# EAGLE design programadorFLASH-prototipo-plano-masa (EAGLE 4.01)
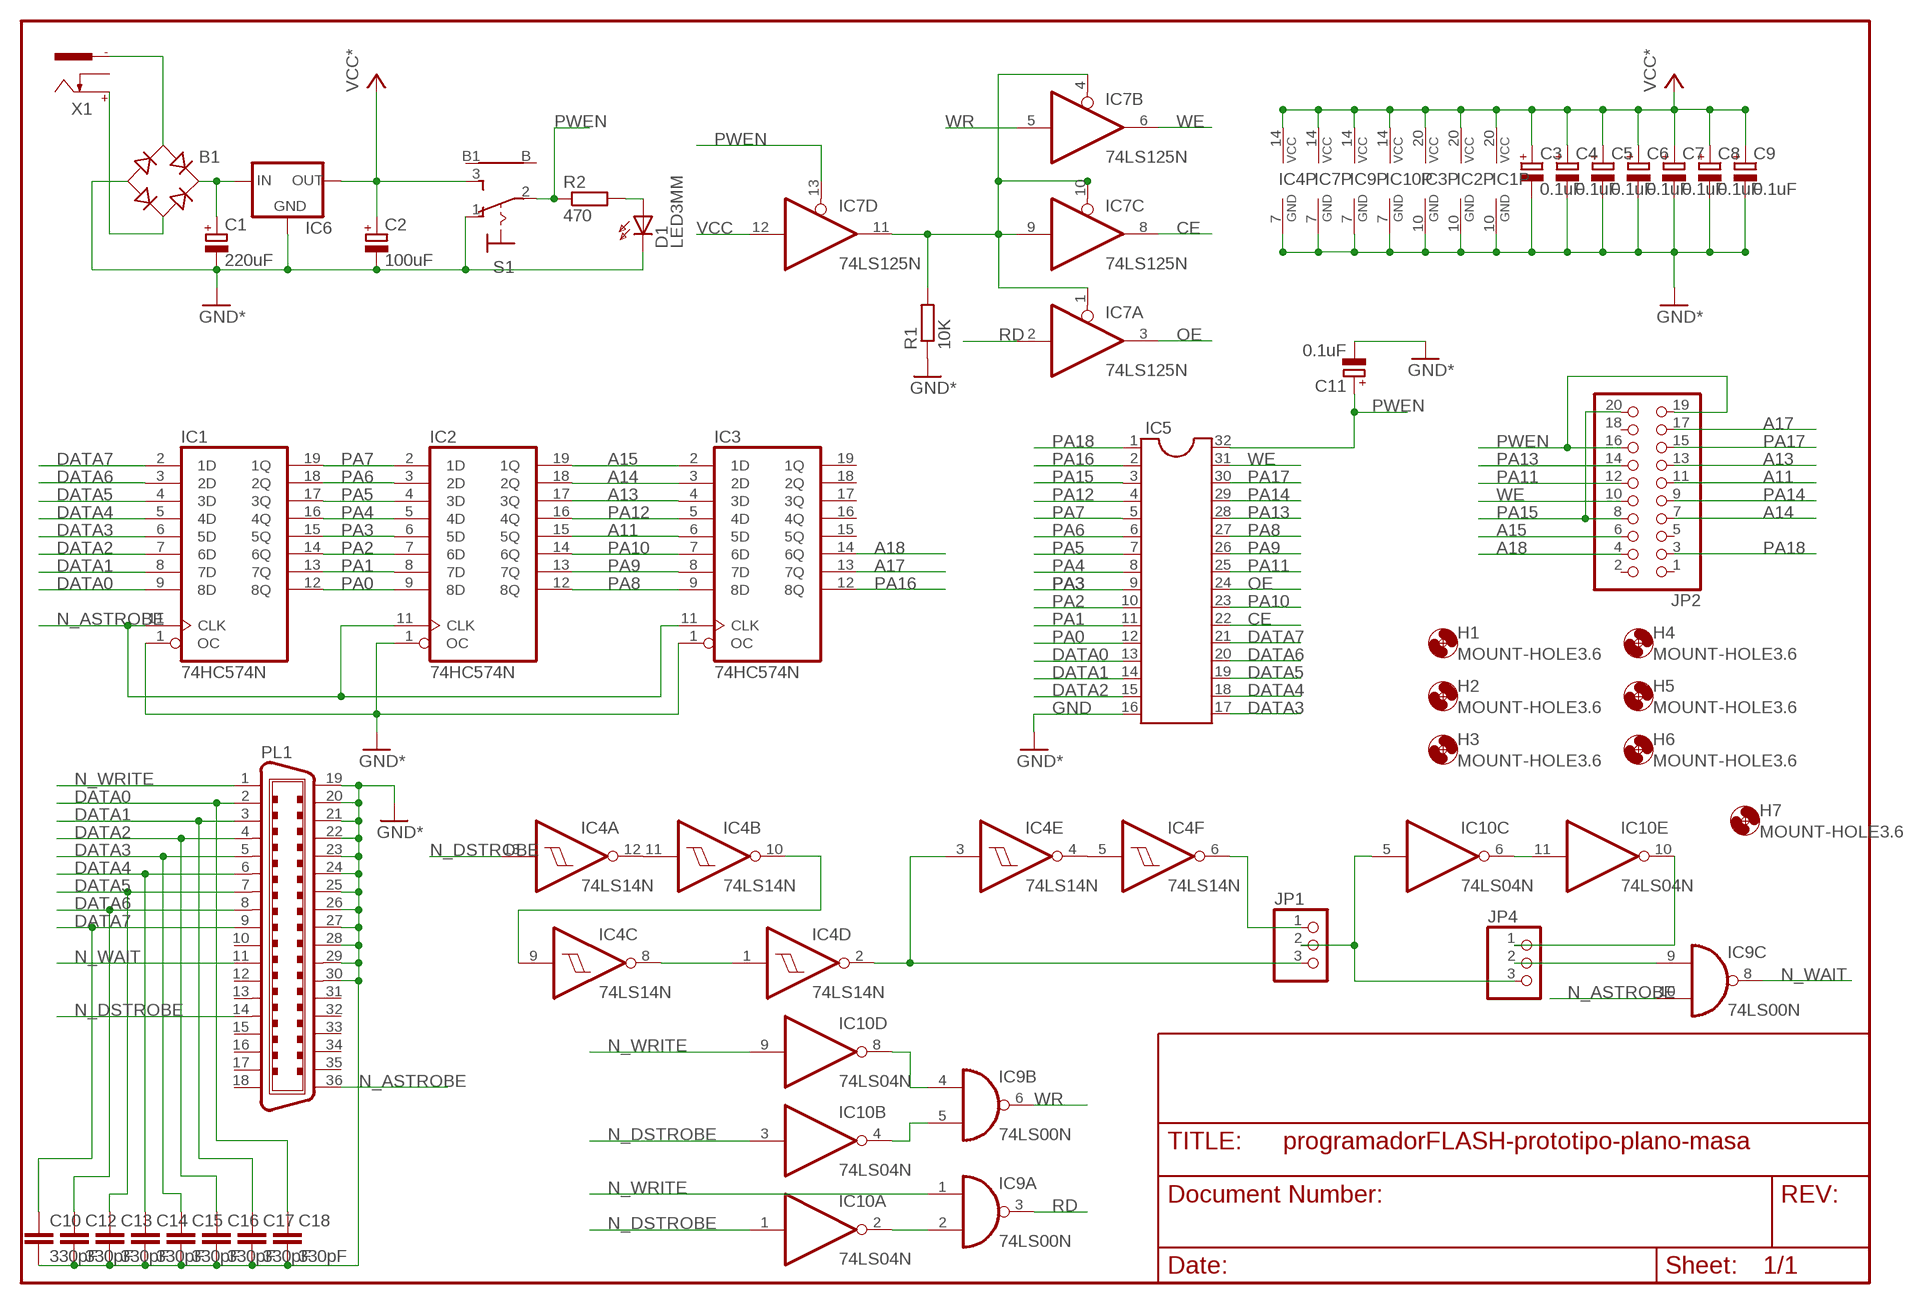
[diagram p0: schematic, sheet 1]

## Parts
B1  RB1A  [RB1A]
C1  220uF  CPOL-EUE3.5-10  [E3,5-10]
C2  100uF  CPOL-EUE2.5-7  [E2,5-7]
C3  0.1uF  CPOL-EUTT5D7  [TT5D7]
C4  0.1uF  CPOL-EUTT5D7  [TT5D7]
C5  0.1uF  CPOL-EUTT5D7  [TT5D7]
C6  0.1uF  CPOL-EUTT5D7  [TT5D7]
C7  0.1uF  CPOL-EUTT5D7  [TT5D7]
C8  0.1uF  CPOL-EUTT5D7  [TT5D7]
C9  0.1uF  CPOL-EUTT5D7  [TT5D7]
C10  330pF  C-EU050-024X044  [C050-024X044]
C11  0.1uF  CPOL-EUTT5D7  [TT5D7]
C12  330pF  C-EU050-024X044  [C050-024X044]
C13  330pF  C-EU050-024X044  [C050-024X044]
C14  330pF  C-EU050-024X044  [C050-024X044]
C15  330pF  C-EU050-024X044  [C050-024X044]
C16  330pF  C-EU050-024X044  [C050-024X044]
C17  330pF  C-EU050-024X044  [C050-024X044]
C18  330pF  C-EU050-024X044  [C050-024X044]
D1  LED3MM  [LED3MM]
H1  MOUNT-HOLE3.6  [3,6]
H2  MOUNT-HOLE3.6  [3,6]
H3  MOUNT-HOLE3.6  [3,6]
H4  MOUNT-HOLE3.6  [3,6]
H5  MOUNT-HOLE3.6  [3,6]
H6  MOUNT-HOLE3.6  [3,6]
H7  MOUNT-HOLE3.6  [3,6]
IC1  74HC574N  [DIL20]
IC2  74HC574N  [DIL20]
IC3  74HC574N  [DIL20]
IC4  74LS14N  [DIL14]
IC5  DIL32  [DIL32]
IC6  78MXXS  [78MXXS]
IC7  74LS125N  [DIL14]
IC9  74LS00N  [DIL14]
IC10  74LS04N  [DIL14]
JP1  PINHD-1X3  [1X03]
JP2  PINHD-2X10  [2X10]
JP4  PINHD-1X3  [1X03]
PL1  C36H  [36H]
R1  10K  R-EU_0207/10  [0207/10]
R2  470  R-EU_0207/10  [0207/10]
S1  INTERRUPTOR  [9070-1W]
X1  NEB21R  [NEB21R]

## Nets
A11: IC2.15(5Q) IC3.6(5D) JP2.11
A13: IC2.17(3Q) IC3.4(3D) JP2.13
A14: IC2.18(2Q) IC3.3(2D) JP2.7
A15: IC2.19(1Q) IC3.2(1D) JP2.6
A17: IC3.13(7Q) JP2.17
A18: IC3.14(6Q) JP2.4
AE: IC7.1(A:OE) IC7.4(B:OE) IC7.9(C:I) IC7.10(C:OE) IC7.11(D:O) R1.2
CE: IC5.22 IC7.8(C:O)
DATA0: C18.2 IC1.9(8D) IC5.13 PL1.2
DATA1: C17.2 IC1.8(7D) IC5.14 PL1.3
DATA2: C16.2 IC1.7(6D) IC5.15 PL1.4
DATA3: C15.2 IC1.6(5D) IC5.17 PL1.5
DATA4: C14.2 IC1.5(4D) IC5.18 PL1.6
DATA5: C13.2 IC1.4(3D) IC5.19 PL1.7
DATA6: C12.2 IC1.3(2D) IC5.20 PL1.8
DATA7: C10.2 IC1.2(1D) IC5.21 PL1.9
GND: B1.- C1.- C2.- C3.- C4.- C5.- C6.- C7.- C8.- C9.- C10.1 C11.- C12.1 C13.1 C14.1 C15.1 C16.1 C17.1 C18.1 D1.K(C) IC1.1(OC) IC1.10(GND) IC2.1(OC) IC2.10(GND) IC3.1(OC) IC3.10(GND) IC4.7(P:GND) IC5.16 IC6.GND IC7.7(P:GND) IC9.7(P:GND) IC10.7(P:GND) PL1.19 PL1.20 PL1.21 PL1.22 PL1.23 PL1.24 PL1.25 PL1.26 PL1.27 PL1.28 PL1.29 PL1.30 R1.1 S1.1(O) ; supply symbol labelled GND*
N$1: IC9.2(A:I1) IC10.2(A:O)
N$2: B1.AC1 X1.-
N$3: B1.+ C1.+ IC6.IN
N$4: D1.A R2.2
N$5: B1.AC2 X1.+
N$6: IC9.5(B:I1) IC10.4(B:O)
N$7: IC9.4(B:I0) IC10.8(D:O)
N$8: IC4.11(B:I) IC4.12(A:O)
N$9: IC4.9(C:I) IC4.10(B:O)
N$10: IC4.1(D:I) IC4.8(C:O)
N$11: IC4.2(D:O) IC4.3(E:I) JP1.3
N$12: IC4.4(E:O) IC4.5(F:I)
N$13: IC4.6(F:O) JP1.1
N$14: IC10.5(C:I) JP1.2 JP4.3
N$15: IC10.6(C:O) IC10.11(E:I)
N$18: IC10.10(E:O) JP4.1
N$19: IC9.9(C:I0) JP4.2
N_ASTROBE: IC1.11(CLK) IC2.11(CLK) IC3.11(CLK) IC9.10(C:I1) PL1.36
N_DSTROBE: IC4.13(A:I) IC10.1(A:I) IC10.3(B:I) PL1.14
N_WAIT: IC9.8(C:O) PL1.11
N_WRITE: IC9.1(A:I0) IC10.9(D:I) PL1.1
OE: IC5.24 IC7.3(A:O)
PA0: IC1.12(8Q) IC2.9(8D) IC5.12
PA1: IC1.13(7Q) IC2.8(7D) IC5.11
PA2: IC1.14(6Q) IC2.7(6D) IC5.10
PA3: IC1.15(5Q) IC2.6(5D) IC5.9
PA4: IC1.16(4Q) IC2.5(4D) IC5.8
PA5: IC1.17(3Q) IC2.4(3D) IC5.7
PA6: IC1.18(2Q) IC2.3(2D) IC5.6
PA7: IC1.19(1Q) IC2.2(1D) IC5.5
PA8: IC2.12(8Q) IC3.9(8D) IC5.27
PA9: IC2.13(7Q) IC3.8(7D) IC5.26
PA10: IC2.14(6Q) IC3.7(6D) IC5.23
PA11: IC5.25 JP2.12
PA12: IC2.16(4Q) IC3.5(4D) IC5.4
PA13: IC5.28 JP2.14
PA14: IC5.29 JP2.9
PA15: IC5.3 JP2.8 JP2.20
PA16: IC3.12(8Q) IC5.2
PA17: IC5.30 JP2.15
PA18: IC5.1 JP2.3
PWEN: C11.+ IC5.32 IC7.13(D:OE) JP2.16 JP2.19 R2.1 S1.2(P)
RD: IC7.2(A:I) IC9.3(A:O)
VCC: C2.+ C3.+ C4.+ C5.+ C6.+ C7.+ C8.+ C9.+ IC1.20(VCC) IC2.20(VCC) IC3.20(VCC) IC4.14(P:VCC) IC6.OUT IC7.12(D:I) IC7.14(P:VCC) IC9.14(P:VCC) IC10.14(P:VCC) S1.3(S) ; supply symbol labelled VCC*
WE: IC5.31 IC7.6(B:O) JP2.10
WR: IC7.5(B:I) IC9.6(B:O)
Unconnected: IC3.15(5Q) IC3.16(4Q) IC3.17(3Q) IC3.18(2Q) IC3.19(1Q) IC9.11(D:O) IC9.12(D:I0) IC9.13(D:I1) IC10.12(F:O) IC10.13(F:I) JP2.1 JP2.2 JP2.5 JP2.18 PL1.10 PL1.12 PL1.13 PL1.15 PL1.16 PL1.17 PL1.18 PL1.31 PL1.32 PL1.33 PL1.34 PL1.35 S1.B S1.B1 X1.C

## Library data of the parts
B1 = rectifier:RB1A: RECTIFIER 1 A
C1-C9 C11 = rcl:CPOL-EU: POLARIZED CAPACITOR, European symbol
C10 C12-C18 = rcl:C-EU: CAPACITOR, European symbol
D1 = led:LED3MM: LED 3 mm, round
H1-H7 = holes:MOUNT-HOLE: MOUNTING HOLE with drill center marker
IC1-IC3 = 74xx-eu:74*574: 8-bit D type FLIP FLOP bus driver
IC4 = 74xx-eu:74*14: Hex schmitt trigger INVERTER
IC5 = dil:DIL32: SOCKET DIL32
IC6 = v-reg:78MXXS: VOLTAGE REGULATOR
IC7 = 74xx-eu:74*125: Quad bus BUFFER, 3-state
IC9 = 74xx-eu:74*00: Quad 2-input NAND gate
IC10 = 74xx-eu:74*04: Hex INVERTER
JP1 JP4 = pinhead:PINHD-1X3: PIN HEADER
JP2 = pinhead:PINHD-2X10: PIN HEADER
PL1 = con-amp-champ:C36H: CONNECTOR
R1 R2 = rcl:R-EU_: RESISTOR, European symbol
S1 = switch:INTERRUPTOR: TOGGLE SWITCH Marquardt
X1 = con-lumberg:NEB21R: CONNECTOR

## Board
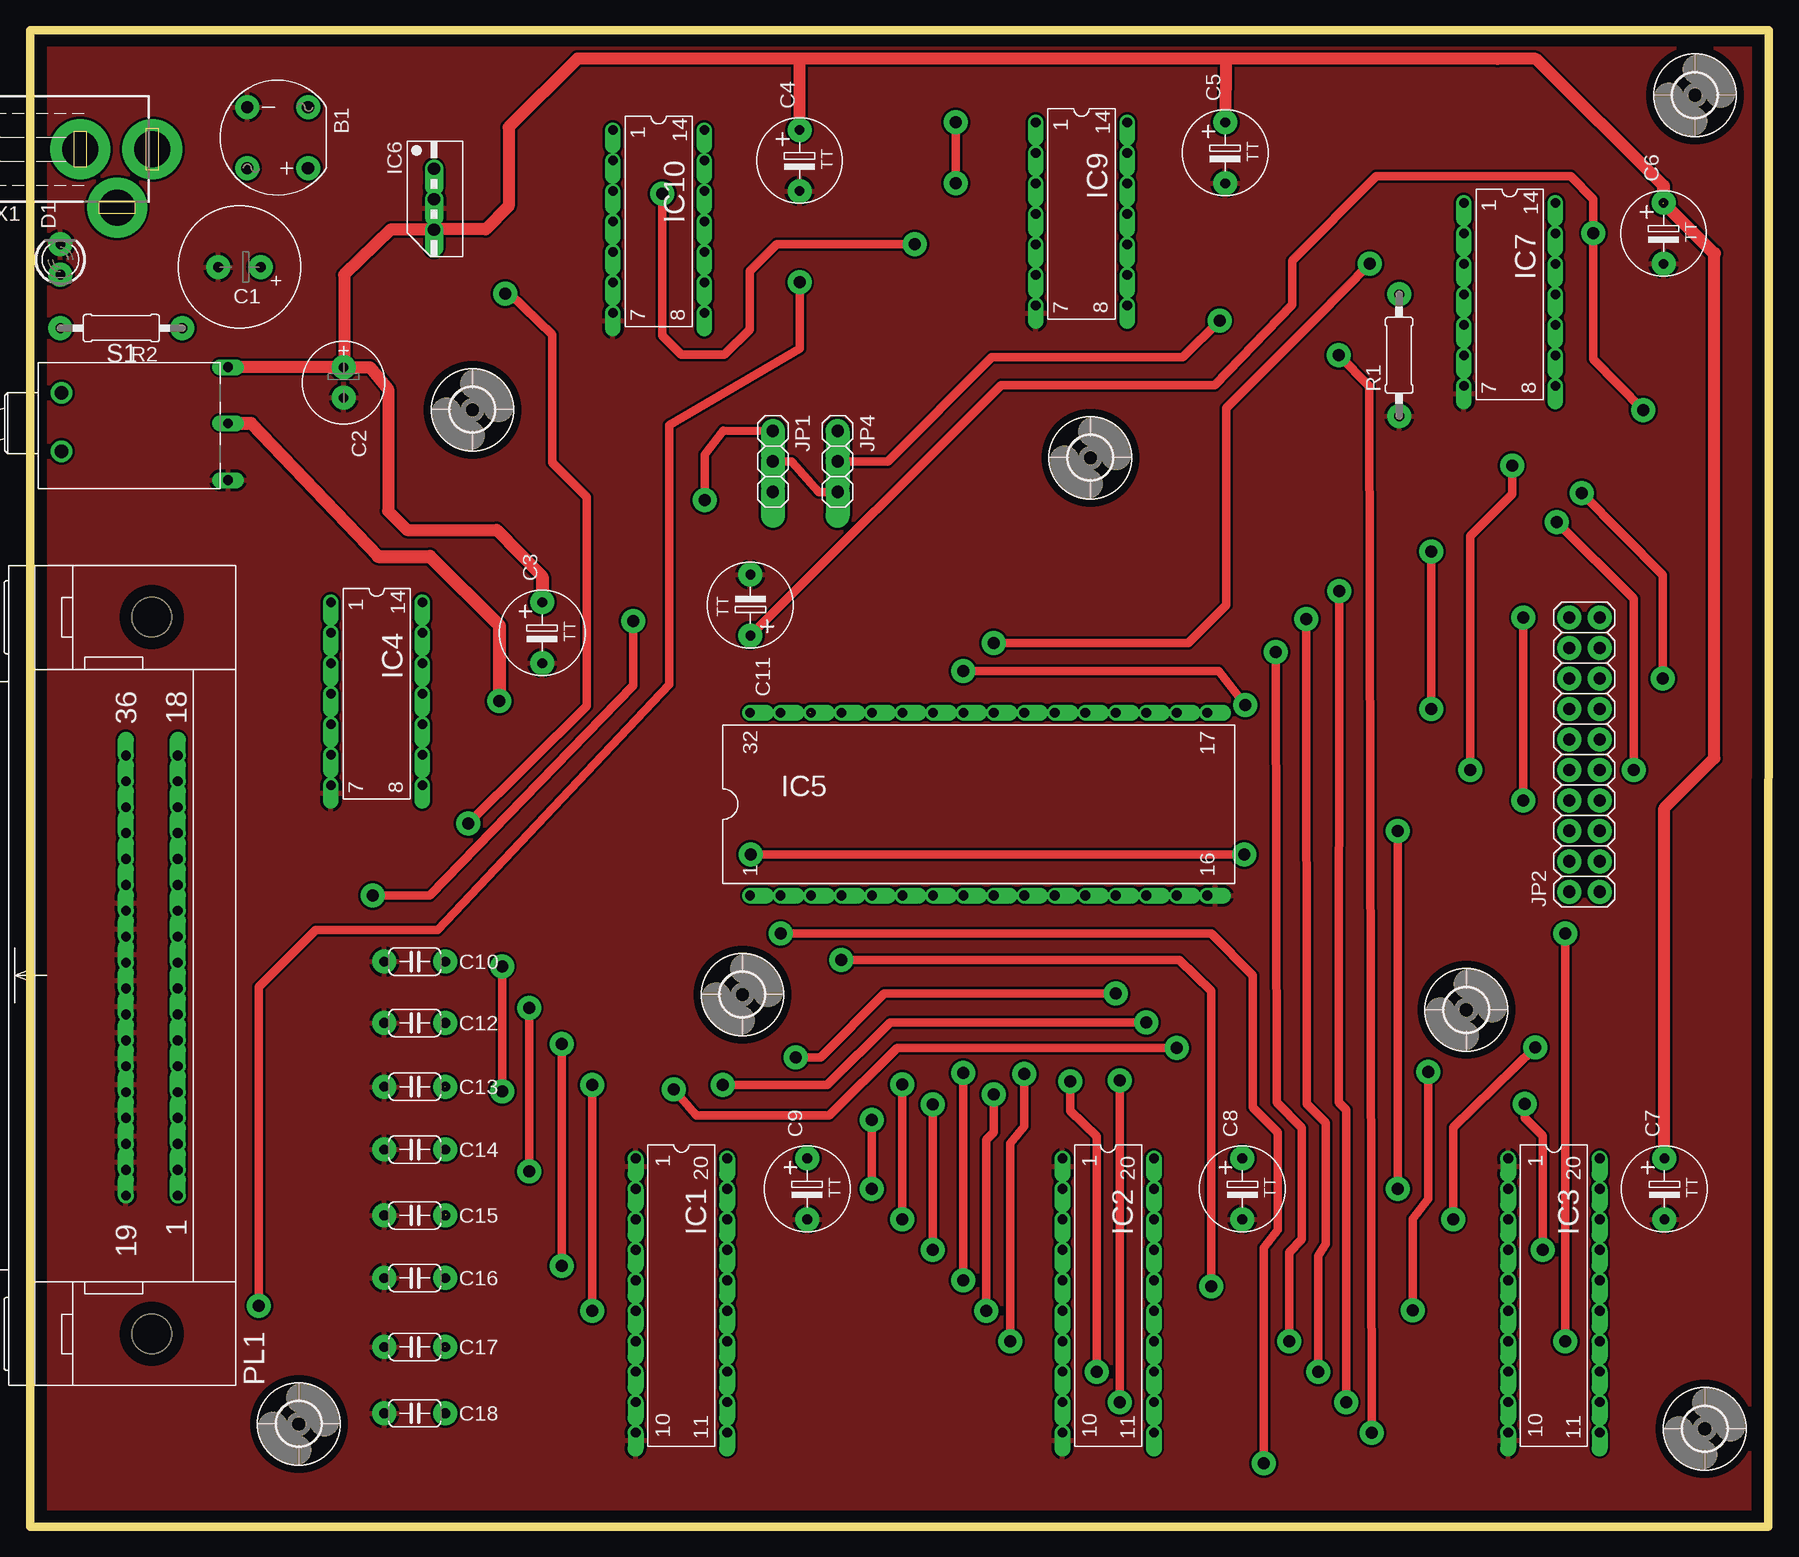
[diagram p1: board, top side]
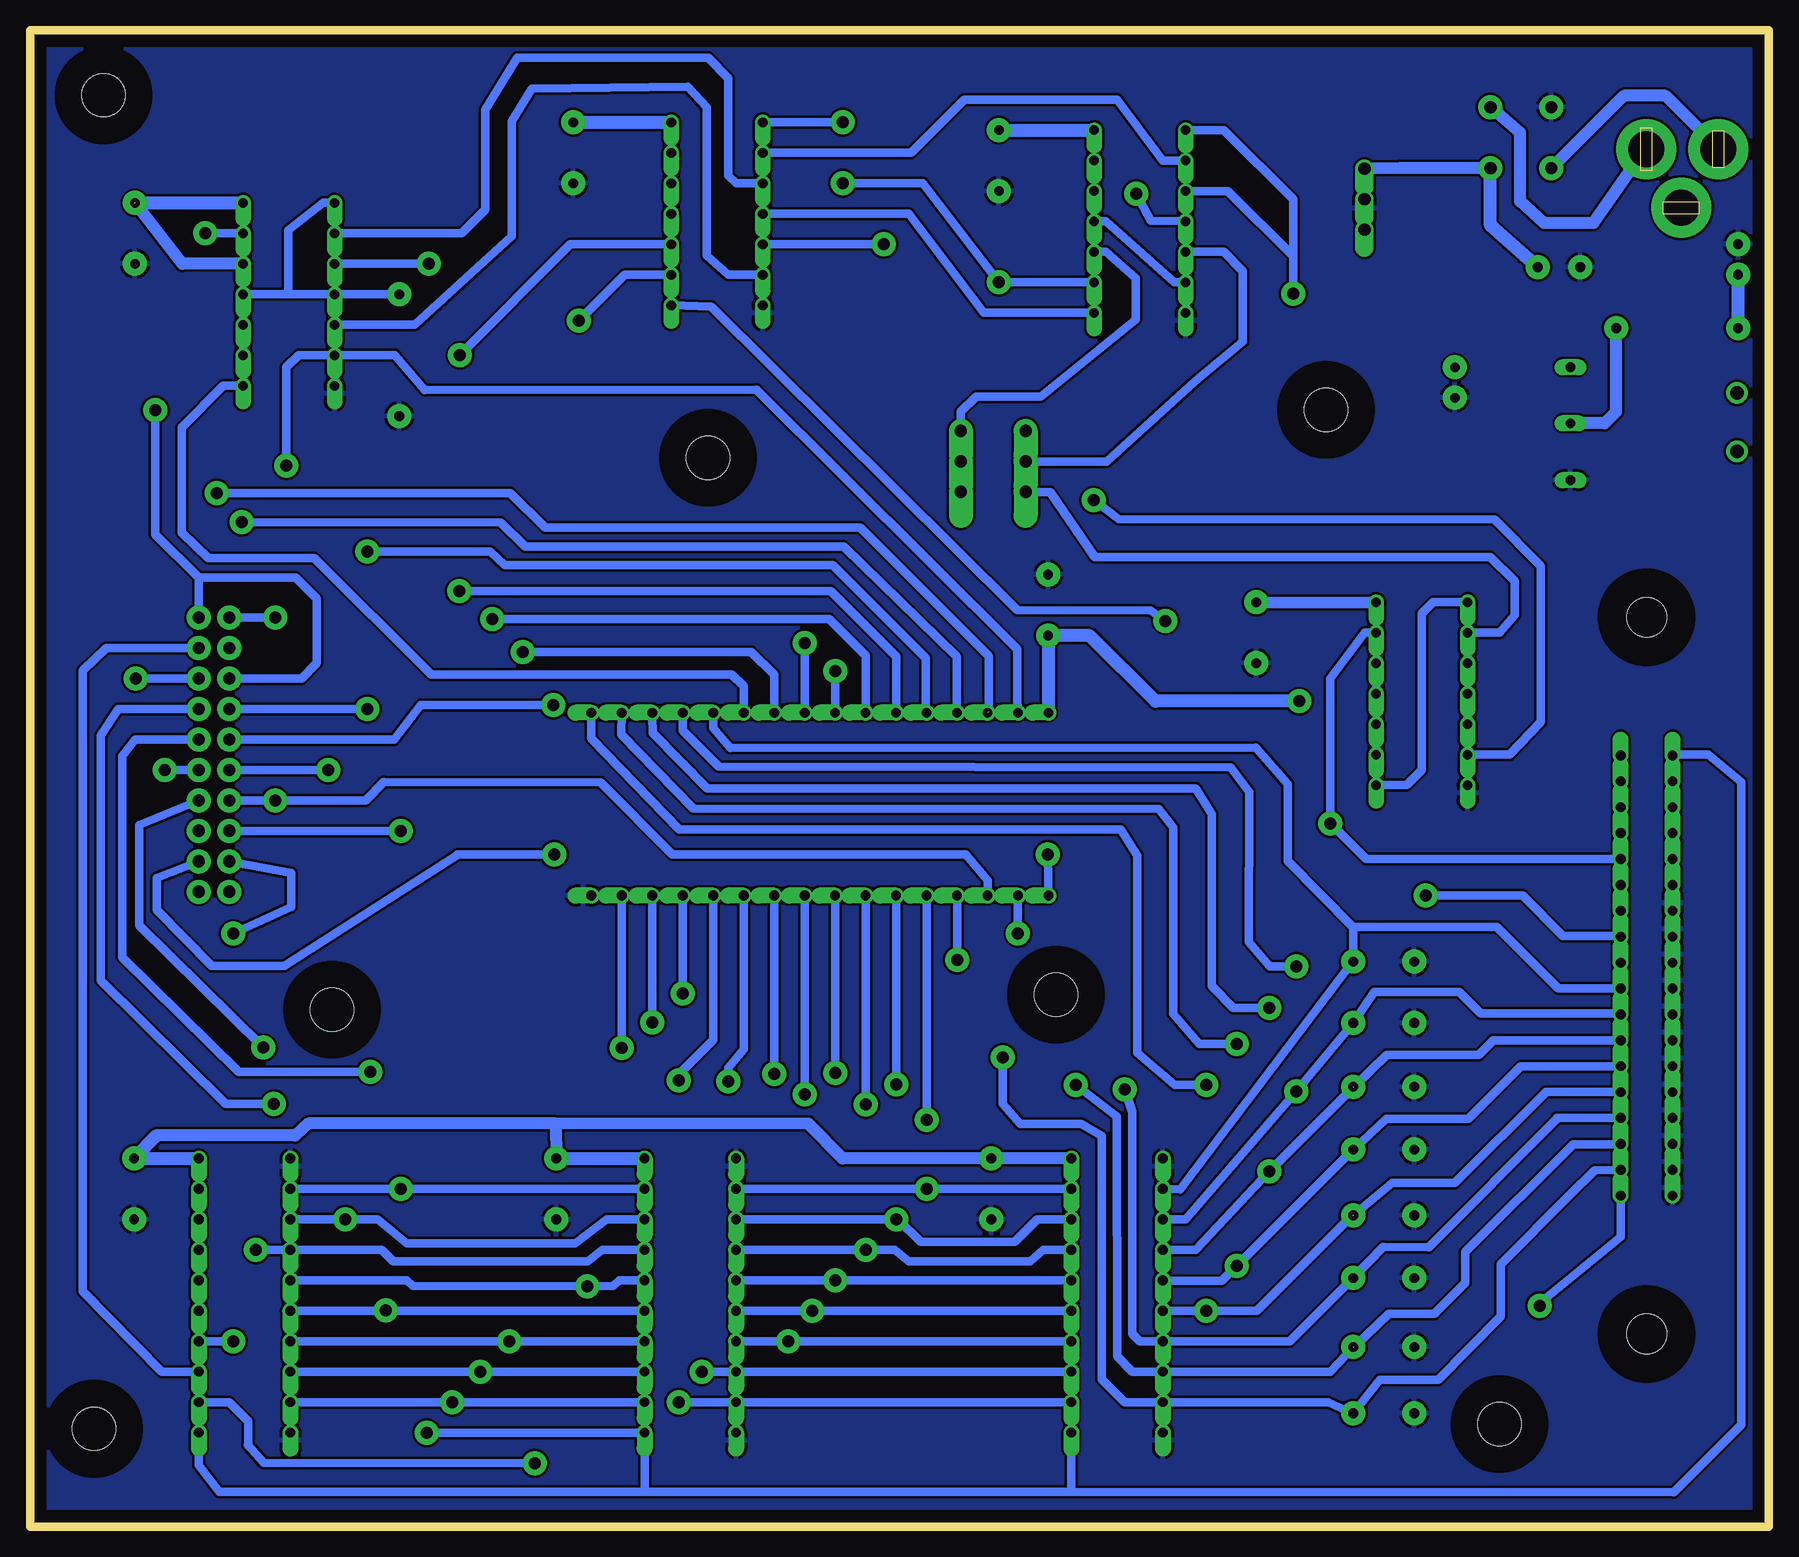
[diagram p2: board, bottom side, seen from below]

Size 144.88 x 124.78 mm. Coordinates in mm from the lower left corner, seen from the top.
Outline: 0,0 144.86,0 144.87,124.78 0,124.78 0,0
Copper layers used: Top, Bottom

### Footprints (pad centres in the part's own frame; a part is rotated, then mirrored left to right if it is on the bottom)
RB1A = drill 1.016 pad 2 round: + -2.54,2.54; - 2.54,-2.54; AC1 2.54,2.54; AC2 -2.54,-2.54
E3,5-10 = drill 0.813 pad 2 round: + -1.778,0; - 1.778,0
E2,5-7 = drill 0.813 pad 2 round: + -1.27,0; - 1.27,0
TT5D7 = drill 0.813 pad 2 round: + 2.54,0; - -2.54,0
C050-024X044 = drill 0.813 pad 2 round: 1 -2.54,0; 2 2.54,0
LED3MM = drill 0.813 pad 2 round: A -1.27,0; K 1.27,0
3,6 = hole 3.6: 0,0
DIL20 = drill 0.813 offset: 1 -11.43,-3.81; 2 -8.89,-3.81; 3 -6.35,-3.81; 4 -3.81,-3.81; 5 -1.27,-3.81; 6 1.27,-3.81; 7 3.81,-3.81; 8 6.35,-3.81; 9 8.89,-3.81; 10 11.43,-3.81; 11 11.43,3.81; 12 8.89,3.81; 13 6.35,3.81; 14 3.81,3.81; 15 1.27,3.81; 16 -1.27,3.81; 17 -3.81,3.81; 18 -6.35,3.81; 19 -8.89,3.81; 20 -11.43,3.81
DIL14 = drill 0.8 offset: 1 -7.62,-3.81; 2 -5.08,-3.81; 3 -2.54,-3.81; 4 0,-3.81; 5 2.54,-3.81; 6 5.08,-3.81; 7 7.62,-3.81; 8 7.62,3.81; 9 5.08,3.81; 10 2.54,3.81; 11 0,3.81; 12 -2.54,3.81; 13 -5.08,3.81; 14 -7.62,3.81
DIL32 = drill 0.813 offset: 1 -19.05,-7.62; 2 -16.51,-7.62; 3 -13.97,-7.62; 4 -11.43,-7.62; 5 -8.89,-7.62; 6 -6.35,-7.62; 7 -3.81,-7.62; 8 -1.27,-7.62; 9 1.27,-7.62; 10 3.81,-7.62; 11 6.35,-7.62; 12 8.89,-7.62; 13 11.43,-7.62; 14 13.97,-7.62; 15 16.51,-7.62; 16 19.05,-7.62; 17 19.05,7.62; 18 16.51,7.62; 19 13.97,7.62; 20 11.43,7.62; 21 8.89,7.62; 22 6.35,7.62; 23 3.81,7.62; 24 1.27,7.62; 25 -1.27,7.62; 26 -3.81,7.62; 27 -6.35,7.62; 28 -8.89,7.62; 29 -11.43,7.62; 30 -13.97,7.62; 31 -16.51,7.62; 32 -19.05,7.62
78MXXS = drill 1.016 offset: GND 0,-2.54; IN -2.54,-2.54; OUT 2.54,-2.54
1X03 = drill 1.016 pad 2 offset: 1 -2.54,0; 2 0,0; 3 2.54,0
2X10 = drill 1.016 pad 2 round: 1 -11.43,-1.27; 2 -11.43,1.27; 3 -8.89,-1.27; 4 -8.89,1.27; 5 -6.35,-1.27; 6 -6.35,1.27; 7 -3.81,-1.27; 8 -3.81,1.27; 9 -1.27,-1.27; 10 -1.27,1.27; 11 1.27,-1.27; 12 1.27,1.27; 13 3.81,-1.27; 14 3.81,1.27; 15 6.35,-1.27; 16 6.35,1.27; 17 8.89,-1.27; 18 8.89,1.27; 19 11.43,-1.27; 20 11.43,1.27
36H = drill 0.813 offset: 1 -18.352,-2.159; 2 -16.192,-2.159; 3 -14.034,-2.159; 4 -11.874,-2.159; 5 -9.716,-2.159; 6 -7.556,-2.159; 7 -5.397,-2.159; 8 -3.239,-2.159; 9 -1.079,-2.159; 10 1.079,-2.159; 11 3.239,-2.159; 12 5.397,-2.159; 13 7.556,-2.159; 14 9.716,-2.159; 15 11.874,-2.159; 16 14.034,-2.159; 17 16.192,-2.159; 18 18.352,-2.159; 19 -18.352,2.159; 20 -16.192,2.159; 21 -14.034,2.159; 22 -11.874,2.159; 23 -9.716,2.159; 24 -7.556,2.159; 25 -5.397,2.159; 26 -3.239,2.159; 27 -1.079,2.159; 28 1.079,2.159; 29 3.239,2.159; 30 5.397,2.159; 31 7.556,2.159; 32 9.716,2.159; 33 11.874,2.159; 34 14.034,2.159; 35 16.192,2.159; 36 18.352,2.159 | hole 3.302: -29.87,0; 29.87,0
0207/10 = drill 0.813 pad 2 round: 1 -5.08,0; 2 5.08,0
9070-1W = drill 0.813 long: 1 5.08,-4.74; 2 5.08,0; 3 5.08,4.68 | drill 1.118 pad 1.778 round: B -8.8,-2.34; B1 -8.8,2.54
NEB21R = drill 3 pad 5 round: + 0,7.35; - 0,1.35; C 4.9,4.4

### Placement (x,y rotation side)
B1  20.63,115.81 180 top
C1  17.46,105.02 180 top
C2  26.13,95.39 270 top
C3  42.68,74.54 90 top
C4  64.12,113.91 90 top
C5  99.6,114.54 90 top
C6  136.13,107.83 90 top
C7  136.2,28.18 90 top
C8  101.02,28.18 90 top
C9  64.77,28.18 90 top
C10  32.06,47.12 0 top
C11  60.04,76.84 270 top
C12  32.06,42.01 0 top
C13  32.06,36.69 0 top
C14  32.06,31.46 0 top
C15  32.06,25.97 0 top
C16  32.06,20.75 0 top
C17  32.06,15 0 top
C18  32.06,9.47 0 top
D1  2.54,105.65 90 top
H1  36.87,93.12 0 top
H2  138.74,119.35 0 top
H3  59.37,44.38 0 top
H4  119.69,43.1 0 top
H5  22.4,8.58 0 top
H6  139.56,8.18 0 top
H7  88.37,89.12 0 top
IC1  54.29,19.29 270 top
IC2  89.85,19.29 270 top
IC3  126.99,19.29 270 top
IC4  28.89,69.46 270 top
IC5  79.05,60.25 0 top
IC6  36.21,110.69 270 top
IC7  123.3,102.75 270 top
IC9  87.62,109.46 270 top
IC10  52.38,108.83 270 top
JP1  61.91,88.83 270 top
JP2  129.53,64.38 90 top
JP4  67.3,88.83 270 top
PL1  10.15,45.96 90 top
R1  114.09,97.67 90 top
R2  7.62,99.94 180 top
S1  11.43,92 0 top
X1  2.85,114.86 270 top

### Tracks (layer width: path | path; a pad name or v marks a point on that pad's centre or on a via)
A11  (via drill 1 pad 2)
  Top 0.7: v116.52,37.95 116.52,27.37 115.25,25.69 v115.25,18.04
  Bottom 0.7: 123.5,18.02 IC3.6 115.25,18.02 | IC2.15 115.25,18.02 | v116.52,37.95 127.49,37.95 137.18,47.46 137.18,64.28 136.1,65.65 JP2.11 | 115.25,18.02 v115.25,18.04
A13  (via drill 1 pad 2)
  Top 0.7: v126.04,23.1 126.08,32.58 124.54,34.08 v124.54,35.25
  Bottom 0.7: IC2.17 97.2,23.1 98.41,22.15 114.61,22.15 115.57,23.1 IC3.4 v126.04,23.1 | v124.54,35.25 128.58,35.25 138.97,45.57 138.97,65.97 137.52,68.19 JP2.13
A14  (via drill 1 pad 2)
  Top 0.7: v125.43,39.96 118.59,33.31 v118.59,25.64
  Bottom 0.7: IC2.18 96.83,25.64 99.46,23.65 113.48,23.65 115.88,25.64 v118.59,25.64 IC3.3 | v125.43,39.96 135.76,50.15 135.76,58.51 JP2.7
A15  (via drill 1 pad 2)
  Top 0.7: v113.98,28.18 v113.98,58.03
  Bottom 0.7: IC2.19 114.61,28.18 | 114.61,28.18 IC3.2 | v113.98,58.03 JP2.6 | 114.61,28.18 v113.98,28.18
A17
  Bottom 0.7: IC3.13 133.91,12.94 140.46,19.63 140.46,71.38 138.5,73.27 JP2.17
A18  (via drill 1 pad 2)
  Top 0.7: v127.95,15.48 v127.95,49.46
  Bottom 0.7: v127.95,49.46 123.11,51.68 123.11,54.5 JP2.4 | v127.95,15.48 IC3.14
AE
  Bottom 0.7: R1.2 IC7.4 123.35,102.75 | IC7.1 120.44,110.37 123.35,108.08 123.35,102.75 | 123.35,102.75 IC7.11 IC7.10 IC7.9
CE
  Bottom 0.7: IC7.8 128.75,95.13 132.24,91.64 132.24,82.89 130.01,80.76 121.18,80.76 111.48,71.08 111.45,71.05 86.41,71.05 85.4,70.09 IC5.22
DATA0  (via drill 1 pad 2)
  Top 0.7: v63.82,39.16 65.88,39.16 71.17,44.45 v90.48,44.45
  Bottom 0.7: PL1.2 14.48,29.71 16.57,27.67 16.59,27.63 22.31,21.91 22.31,17.55 27.54,12.28 32.38,12.28 C18.2 34.59,9.43 36.7,10.39 IC1.9 53.65,10.4 55.56,12.31 55.56,32.6 57.26,33.59 62.35,33.58 63.81,35.28 v63.82,39.16 | v90.48,44.45 IC5.13
DATA1  (via drill 1 pad 2)  (1 unrouted)
  Top 0.7: v93.02,42.05 71.67,42.05 66.46,36.84 v57.74,36.84
  Bottom 0.7: v93.02,42.05 IC5.14 | v57.74,36.84 57.72,36.84 54.31,34.22 54.29,14.21 53.02,12.94 IC1.8 36.52,12.94 34.56,15.01 34.53,15.01 31.66,17.77 27.85,17.77 25.28,20.33 25.27,22.94 16.26,31.91 12.3,31.91 12.3,31.93 | 12.3,31.93 12.3,31.96 | PL1.3 12.3,31.93
DATA2  (via drill 1 pad 2)
  Top 0.7: v53.66,36.46 55.51,34.3 66.62,34.3 72.27,39.94 v95.56,39.94 95.68,39.94
  Bottom 0.7: PL1.4 17.65,34.09 17.6,34.05 28.31,23.29 32.1,23.33 34.59,20.78 | v53.66,36.46 53.01,34.61 53.02,31.36 53.02,16.12 52.38,15.48 IC1.7 39.89,15.48 34.59,20.78 | v95.56,39.94 IC5.15 | 34.59,20.78 C16.2
DATA3  (via drill 1 pad 2)  (1 unrouted)
  Top 0.7: v46.85,18.02 v46.85,36.85
  Bottom 0.7: PL1.5 18.57,36.25 18.54,36.27 26.16,28.7 31.36,28.7 C15.2 | 34.65,26 42.63,18.02 v46.85,18.02 IC1.6 | IC5.17 98.1,65.74 90.75,58.13 53.98,58.13 52.59,55.96 52.6,39.53 49.46,36.85 v46.85,36.85
DATA4  (via drill 1 pad 2)
  Top 0.7: v44.3,21.76 v44.3,40.25
  Bottom 0.7: PL1.6 20.65,38.41 20.67,38.35 25.03,34 31.85,34 34.56,31.48 C14.2 34.67,31.38 v44.3,21.76 45.55,20.53 50.63,20.53 IC1.5 | IC5.18 95.62,66.04 89.6,59.88 50.83,59.87 49.62,58.3 49.61,42.75 47.45,40.25 v44.3,40.25
DATA5  (via drill 1 pad 2)  (2 unrouted)
  Top 0.7: v41.59,29.62 v41.59,43.27
  Bottom 0.7: PL1.7 22.97,40.57 23,40.53 24.13,39.34 31.81,39.34 34.58,36.67 v41.59,29.62 47.72,23.1 50.46,23.1 | IC5.19 93.02,67.55 92.98,66.18 88.43,61.56 47.72,61.57 46.38,59.41 46.38,45.09 44.61,43.27 v41.59,43.27
DATA6  (via drill 1 pad 2)
  Top 0.7: v39.36,36.31 v39.33,46.74
  Bottom 0.7: PL1.8 12.33,42.72 13.01,42.79 23.98,42.79 23.98,42.81 25.77,44.59 32.84,44.59 C12.2 v39.36,36.32 v39.36,36.31 48.55,25.66 48.57,25.64 IC1.3 | IC5.20 90.48,67.94 90.48,67.78 90.48,66.38 87.46,63.38 44.8,63.31 43.29,61.28 43.3,48.75 41.55,46.74 v39.33,46.74
DATA7
  Bottom 0.7: 12.29,44.87 PL1.9 17.54,44.88 22.63,50 34.61,50 34.61,49.96 | IC5.21 87.94,66.6 86.53,64.93 42.72,64.98 40.06,61.95 40.06,55.53 34.61,49.96 | 34.61,47.1 C10.2 | 34.61,49.96 34.61,47.1 | IC1.2 49.04,28.15 34.59,47.18 34.61,47.1
GND
  pour Bottom: 0.91,123.7 144.45,123.7 144.45,70.92 144.45,0.63 49.01,0.63 0.87,0.63 0.87,123.7 0.9,123.7
  pour Top: 0.94,123.64 144.44,123.64 144.44,105.91 144.44,0.62 138.59,0.62 0.94,0.62 0.94,123.6
N$1
  Bottom 0.7: IC10.2 50.48,113.91 54.29,118.99 67.01,118.99 71.44,114.54 IC9.2
N$2
  Bottom 1: B1.AC1 12.06,119.3 8.57,119.3 5.39,116.13 X1.-
N$3
  Bottom 1: IC6.IN 30.68,113.28 B1.+
  Bottom 1.1: B1.+ 23.17,108.51 20.31,105.97 C1.+
N$4
  Bottom 1.1: R2.2 D1.A
N$5
  Bottom 0.7: 23.18,118.38 B1.AC2
  Bottom 1: 11.62,112.96 14.6,108.69 18.7,108.69 20.7,110.51 20.71,116.22 23.18,118.38
  Bottom 1.1: 11.62,112.96 X1.+
N$6  (via drill 1 pad 2)
  Top 0.7: v73.73,106.92 62.22,106.92 59.97,104.66 59.97,99.82 57.86,97.72 54.29,97.72 52.7,99.3 v52.7,111.13
  Bottom 0.7: v52.7,111.13 51.48,108.88 IC10.4 | v73.73,106.92 IC9.5
N$7
  Bottom 0.7: IC10.8 65.39,101.21 71.64,109.46 IC9.4
N$8
  Bottom 0.7: IC4.11 IC4.12
N$9
  Bottom 0.7: IC4.9 IC4.10
N$10
  Bottom 0.7: IC4.1 27.94,77.08 28.89,76.13 28.89,63.11 30.16,61.84 IC4.8
N$11
  Bottom 0.7: IC4.3 IC4.2 22.41,74.54 21.14,76.01 21.14,78.85 23.21,80.83 56.16,80.83 59.84,86.28 JP1.3
N$12
  Bottom 0.7: IC4.5 IC4.4
N$13  (via drill 1 pad 2)
  Top 0.7: v56.22,85.58 56.23,89.39 57.79,91.4 JP1.1
  Bottom 0.7: v56.22,85.58 54.14,84.03 22.83,83.97 18.97,80.1 18.97,67.08 21.58,64.38 IC4.6
N$14
  Top 0.7: JP1.2 63.48,88.83 65.74,86.27 JP4.3
  Bottom 0.7: IC10.5 45.4,106.29 43.81,104.7 43.82,98.8 47.79,95.51 55.16,88.81 59.24,88.81 JP1.2
N$15
  Bottom 0.7: IC10.6 49.52,103.75 55.24,108.83 IC10.11
N$18
  Bottom 0.7: JP4.1 67.3,92.95 66.04,94.22 60.64,94.22 52.73,100.66 52.73,104.1 55.24,106.29 IC10.10
N$19  (via drill 1 pad 2)
  Top 0.7: v99.13,100.57 96.05,97.5 80.16,97.5 71.47,88.81 JP4.2
  Bottom 0.7: v99.13,100.57 95.32,104.38 IC9.9
N_ASTROBE  (via drill 1 pad 2)
  Top 0.7: v111.8,7.85 111.62,95.09 v109.05,97.66
  Bottom 0.7: 58.12,2.92 58.12,7.81 IC1.11 | IC3.11 130.8,5.12 129.12,2.92 93.65,2.92 | 58.12,2.92 93.65,2.92 | v109.05,97.66 99.87,106.92 IC9.10 | PL1.36 7.93,64.38 5.02,64.38 2.27,62.1 2.27,8.52 7.89,2.9 58.12,2.92 | v111.8,7.85 93.71,7.84 IC2.11 93.66,7.92 93.65,2.92
N_DSTROBE  (via drill 1 pad 2)
  Top 0.7: v39.61,102.8 39.98,102.8 43.52,99.38 43.51,88.73 46.4,85.87 46.4,68.44 v36.51,58.64
  Bottom 0.7: PL1.14 33.52,55.68 36.51,58.66 36.51,70.73 | IC4.13 33.65,74.54 36.51,70.73 | 39.61,105.94 45.08,111.37 IC10.3 | IC10.1 45.4,116.45 39.61,110.69 39.61,105.94 | v39.61,102.8 39.61,105.94 | 36.51,70.73 v36.51,58.64
N_WAIT  (via drill 1 pad 2)
  Top 0.7: v50.25,75.53 50.25,70.15 33.33,52.63 v28.57,52.63
  Bottom 0.7: v50.25,75.53 51.48,76.38 62.59,76.43 88.1,101.74 IC9.8 | v28.57,52.63 20.49,52.62 17.14,49.25 12.23,49.25 12.28,49.2 PL1.11
N_WRITE  (via drill 1 pad 2)
  Top 0.7: v77.15,112 v77.15,117.08 | v19.08,18.44 19.05,45 23.81,49.77 33.97,49.77 53.28,70.22 53.26,88.13 53.25,91.86 64.13,98.23 v64.13,103.75
  Bottom 0.7: v77.15,117.08 IC9.1 | IC10.9 v64.13,103.75 70.48,112 v77.15,112 | PL1.1 12.31,24.2 19.18,18.57 v19.08,18.44
OE  (via drill 1 pad 2)
  Top 0.7: v80.32,73.67 96.51,73.69 99.68,76.85 99.67,93.25 107.31,100.89 v111.66,105.29
  Bottom 0.7: v111.66,105.29 IC7.3 | IC5.24 v80.32,73.67
PA0  (via drill 1 pad 2)
  Top 0.7: v90.8,10.4 v90.8,37.23
  Bottom 0.7: IC1.12 IC2.9 v90.8,10.4 | IC5.12 87.94,40.58 90.8,37.71 v90.8,37.23
PA1  (via drill 1 pad 2)
  Top 0.7: v88.9,12.94 88.91,32.57 86.69,34.68 v86.69,37.14
  Bottom 0.7: IC1.13 IC2.8 v88.9,12.94 | IC5.11 85.4,39.79 86.68,38.28 v86.69,37.14
PA2  (via drill 1 pad 2)
  Top 0.7: v81.68,15.48 81.68,25.78 81.68,31.98 82.86,33.38 v82.86,37.75
  Bottom 0.7: 86.35,15.48 IC2.7 v81.68,15.48 IC1.14 | v82.86,37.75 IC5.10
PA3  (via drill 1 pad 2)
  Top 0.7: v79.68,18.02 79.68,32.28 80.32,32.88 v80.32,36.05
  Bottom 0.7: IC1.15 v79.68,18.02 IC2.6 | v80.32,36.05 IC5.9
PA4  (via drill 1 pad 2)
  Top 0.7: v77.78,20.56 v77.78,37.85
  Bottom 0.7: 86.35,20.56 IC2.5 v77.78,20.56 IC1.16 | v77.78,37.85 IC5.8
PA5  (via drill 1 pad 2)
  Top 0.7: v75.24,23.1 v75.24,35.23
  Bottom 0.7: IC1.17 60.46,23.1 61.51,22.15 71.65,22.15 72.8,23.1 v75.24,23.1 IC2.4 | v75.24,35.23 IC5.7
PA6  (via drill 1 pad 2)
  Top 0.7: v72.7,25.64 v72.69,36.9
  Bottom 0.7: IC1.18 60.92,25.64 62.81,23.76 70.63,23.76 72.58,25.64 v72.7,25.64 IC2.3 | v72.69,36.9 IC5.6
PA7  (via drill 1 pad 2)
  Top 0.7: v70.16,28.18 v70.16,33.93
  Bottom 0.7: IC1.19 v70.16,28.18 IC2.2 | v70.16,33.93 IC5.5
PA8  (via drill 1 pad 2)
  Top 0.7: v109.67,10.4 109.67,12.11 109.68,22.88 109.68,34.78 109.08,35.38 v109.1,78
  Bottom 0.7: IC2.12 v109.67,10.4 IC3.9 | IC5.27 72.7,72.57 78.13,78 v109.1,78
PA9  (via drill 1 pad 2)
  Top 0.7: v107.36,12.94 107.36,22.58 107.98,23.58 107.98,33.68 106.38,35.28 v106.36,75.67
  Bottom 0.7: IC2.13 v107.36,12.94 IC3.8 | IC5.26 75.24,72.63 78.28,75.67 v106.36,75.67
PA10  (via drill 1 pad 2)
  Top 0.7: v104.92,15.48 104.92,22.88 105.98,23.98 105.98,33.28 103.88,35.38 v103.82,72.95
  Bottom 0.7: IC2.14 v104.92,15.48 IC3.7 | IC5.23 82.86,71.05 84.77,72.95 v103.82,72.95
PA11  (via drill 1 pad 2)
  Top 0.7: v77.78,71.36 99.05,71.36 v101.28,68.5
  Bottom 0.7: v101.28,68.5 112.3,68.5 114.52,65.65 JP2.12 | IC5.25 v77.78,71.36
PA12  (via drill 1 pad 2)
  Top 0.7: v98.42,20.06 98.42,44.69 95.78,47.25 v67.62,47.25
  Bottom 0.7: IC2.16 95.78,20.56 96.28,20.08 v98.42,20.06 112.98,20.08 113.48,20.56 IC3.5 | v67.62,47.25 IC5.4
PA13  (via drill 1 pad 2)
  Top 0.7: v116.77,81.32 v116.77,68.19
  Bottom 0.7: v116.77,81.32 106.5,81.32 105.33,80.16 77.98,80.16 70.23,72.42 70.23,67.88 70.16,67.91 IC5.28 | v116.77,68.19 JP2.14
PA14  (via drill 1 pad 2)
  Top 0.7: v127.24,83.75 133.66,77.39 v133.66,63.11
  Bottom 0.7: v127.24,83.75 105.65,83.74 103.59,81.74 77.04,81.74 67.66,72.55 67.66,67.91 67.79,68.05 67.59,67.71 67.82,68.04 IC5.29 | v133.66,63.11 JP2.9
PA15  (via drill 1 pad 2)
  Top 0.7: v124.46,60.57 v124.46,75.81
  Bottom 0.7: 128.58,60.57 JP2.8 v124.46,60.57 116.88,60.57 115.38,62.08 97.33,62.07 91.36,56.06 66.9,56.06 65.08,53.9 IC5.3 | v124.46,75.81 JP2.20
PA16  (via drill 1 pad 2)
  Top 0.7: v102.81,5.32 102.81,23.28 103.98,24.78 103.98,32.88 101.88,34.98 101.91,45.96 98.42,49.46 v62.54,49.46
  Bottom 0.7: IC3.12 128.27,10.4 126.68,8.82 126.68,6.82 126.72,6.86 125.38,5.35 v102.81,5.32 | v62.54,49.46 IC5.2
PA17  (via drill 1 pad 2)  (1 unrouted)
  Top 0.7: v129.3,86.19 136.07,79.35 v136.07,70.73
  Bottom 0.7: 64.99,67.95 64.99,72.59 75.71,83.3 101.96,83.3 104.87,86.19 v129.3,86.19 | v136.07,70.73 JP2.15
PA18  (via drill 1 pad 2)
  Top 0.7: v60.07,56.07 v101.18,56.07
  Bottom 0.7: v60.07,56.07 60,53.9 IC5.1 | v101.18,56.07 109.27,56.07 109.19,56.04 123.7,46.75 129.74,46.75 134.29,51.42 134.29,54.1 JP2.3
PWEN  (via drill 1 pad 2)
  Top 0.7: v134.43,93.11 130.29,97.35 v130.29,107.83 130.29,110.69 128.38,112.59 112.21,112.59 105.17,105.54 105.17,101.88 98.74,95.17 80.96,95.17 C11.+
  Top 1: 18.4,92.01 29.02,80.9
  Top 1.1: 29.02,80.9 33.33,80.9 39.11,75.13 v39.11,68.83 | S1.2 18.4,92.01
  Bottom 0.7: v130.29,107.83 128.06,107.83 IC7.13 | v134.43,93.11 134.43,82.72 130.8,79.13 | 130.8,79.13 JP2.19 | 130.8,79.13 122.73,79.13 120.96,77.38 120.96,72 122.23,70.73 JP2.16
  Bottom 1: R2.1 12.7,92.95 13.65,92 S1.2
  Bottom 1.1: IC5.32 C11.+ 56.58,74.3 51.08,68.83 v39.11,68.83
RD
  Bottom 0.7: IC9.3 86.04,112 86.67,112.64 86.67,120.75 88.36,122.48 104.27,122.48 106.92,118.13 106.92,109.79 108.9,107.83 IC7.2
VCC  (1 unrouted)
  Top 0.508: C2.+ 26.35,96.13 26.18,96.78
  Top 0.7: 136.13,110.35 C6.+
  Top 1: 99.63,122.39 64.1,122.39 | 64.1,122.39 64.12,116.39 | 99.63,122.39 C5.+ | C2.+ 28.33,96.66 29.84,94.86 29.84,84.7 31.43,83.11 38.88,83.11 42.68,79.21 | 64.1,122.39 45.63,122.39 39.88,116.68 39.88,110.08 39.86,110.08 37.98,108.18 33.78,108.18 33.78,108.15 IC6.OUT 30.08,108.15 26.18,104.38 26.18,96.78 | 140.37,106.14 140.37,64.08 136.2,59.93 C7.+ | C2.+ 26.18,96.66 26.28,96.58 | C2.+ 16.51,96.66 | 136.13,111.78 125.48,122.38 122.28,122.38 122.28,122.39 99.63,122.39
  Top 1.1: C6.+ 136.13,111.78 | C5.+ | 64.12,116.39 64.13,116.39 C4.+ | 42.68,79.21 C3.+ | 140.37,106.14 136.13,110.35 | C2.+ 25.93,96.88 | 16.51,96.66 S1.3
  Bottom 0.7: C8.+ IC2.20
  Bottom 1: IC1.20 C9.+ 77.15,30.72 79.99,33.62 101.05,33.63 | 101.05,33.63 121.67,33.64 122.78,32.63 134.3,32.63 | 101.05,33.63 C8.+ | IC7.12 132.17,105.29 136.11,110.37 | C3.+ IC4.14
  Bottom 1.1: 134.3,32.63 C7.+ IC3.20 | C8.+ IC2.20 | C4.+ IC10.14 | C5.+ IC9.14 | C6.+ IC7.14
WE  (via drill 1 pad 2)
  Top 0.7: v123.5,88.47 123.5,86.09 120.01,82.6 v120.01,63.11
  Bottom 0.7: IC5.31 62.54,68.5 62.59,68.05 62.59,73.19 84.36,94.79 111.98,94.78 114.48,97.67 IC7.6 122.48,97.68 123.5,96.68 v123.5,88.47 | v120.01,63.11 JP2.10
WR
  Bottom 0.7: IC9.6 86.67,104.38 88.47,105.97 88.47,118.35 90.08,120.04 103.08,119.9 104.75,117.16 104.75,107.62 112.82,100.21 IC7.5